# EAGLE design CNC-MainBoard (EAGLE 6.3)
CNC Control Panel Main and Stepper Board Acts as the brain for the whole system Connects to other boards via "slots" in the form of JBUS connectors which carry SPI, system clock and one interrupt line Runs the upload interface via CDC-ACM in USB One dedicated MCU per axis running all the physics for each movement Also reads the limit switches Can do linear or circular movement Can buffer the next move while the current one is executing Can halt movement in progress SPI slave interface + interrupt line to the main MCU
Assembly variants: ProMini, 20MHz
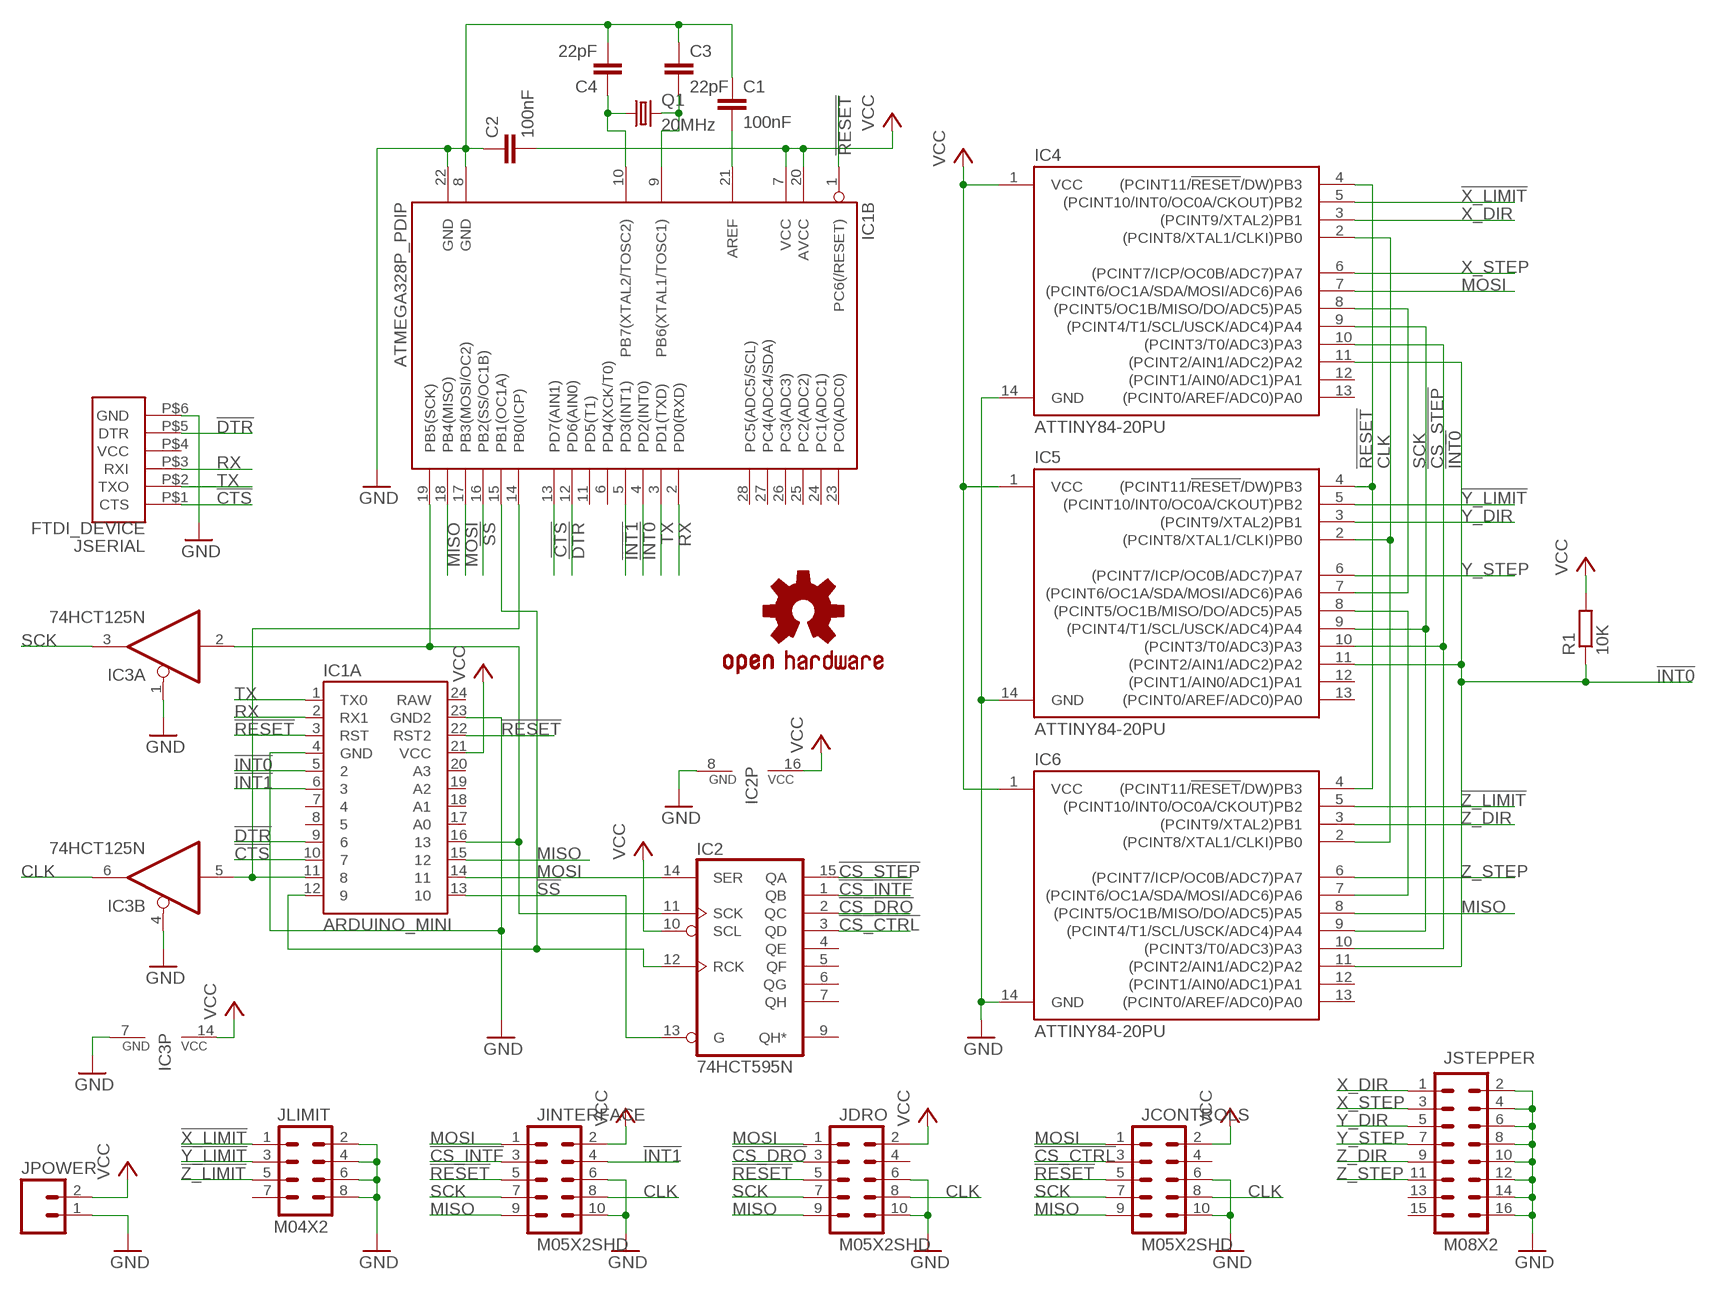
[diagram p0: schematic, sheet 1]

## Parts
C1  100nF  C-EU050-025X075  [C050-025X075]  (not fitted in variant ProMini)
C2  100nF  C-EU050-025X075  [C050-025X075]  (not fitted in variant ProMini)
C3  22pF  C-EU050-025X075  [C050-025X075]  (not fitted in variant ProMini)
C4  22pF  C-EU050-025X075  [C050-025X075]  (not fitted in variant ProMini)
IC1A  ARDUINO_MINI  [ARDUINO_MINI]
IC1B  ATMEGA328P_PDIP  [DIL28-3]  (not fitted in variant ProMini)
IC2  74HCT595N  [DIL16]
IC3  74HCT125N  [DIL14]
IC4  ATTINY84-20PU  [DIL14]
IC5  ATTINY84-20PU  [DIL14]
IC6  ATTINY84-20PU  [DIL14]
JCONTROLS  M05X2SHD  [2X5-SHROUDED]
JDRO  M05X2SHD  [2X5-SHROUDED]
JINTERFACE  M05X2SHD  [2X5-SHROUDED]
JLIMIT  M04X2  [2X4]
JPOWER  M02POLAR  [MOLEX-1X2]
JSERIAL  FTDI_DEVICE  [FTDI_DEVICE_SIDE]
JSTEPPER  M08X2  [2X8]
Q1  20MHz  CRYSTALHC49U-V  [HC49U-V]  (not fitted in variant ProMini)
R1  10K  R-EU_0207/10  [0207/10]
U$1  SPARKFUN_OSHW-LOGOL  [SPARKFUN_OSHW-LOGO-L]

## Nets
!CS_CTRL: IC2.3(QD) JCONTROLS.3
!CS_DRO: IC2.2(QC) JDRO.3
!CS_INTF: IC2.1(QB) JINTERFACE.3
!CS_STEP: IC2.15(QA) IC4.10((PCINT3/T0/ADC3)PA3) IC5.10((PCINT3/T0/ADC3)PA3) IC6.10((PCINT3/T0/ADC3)PA3)
!CTS: IC1A.10 IC1B.13(PD7(AIN1)) JSERIAL.P$1(CTS)
!DTR: IC1A.9 IC1B.12(PD6(AIN0)) JSERIAL.P$5(DTR)
!INT0: IC1A.5 IC1B.4(PD2(INT0)) IC4.11((PCINT2/AIN1/ADC2)PA2) IC5.11((PCINT2/AIN1/ADC2)PA2) IC6.11((PCINT2/AIN1/ADC2)PA2) R1.1
!INT1: IC1A.6 IC1B.5(PD3(INT1)) JINTERFACE.4
!RESET: IC1A.3(RST) IC1A.22(RST2) IC1B.1(PC6(/RESET)) IC4.4((PCINT11/!RESET!/DW)PB3) IC5.4((PCINT11/!RESET!/DW)PB3) IC6.4((PCINT11/!RESET!/DW)PB3) JCONTROLS.5 JDRO.5 JINTERFACE.5
!SS: IC1A.13 IC1B.16(PB2(SS/OC1B)) IC2.13(G)
!X_LIMIT: IC4.5((PCINT10/INT0/OC0A/CKOUT)PB2) JLIMIT.1
!Y_LIMIT: IC5.5((PCINT10/INT0/OC0A/CKOUT)PB2) JLIMIT.3
!Z_LIMIT: IC6.5((PCINT10/INT0/OC0A/CKOUT)PB2) JLIMIT.5
CLK: IC3.6(B:O) IC4.2((PCINT8/XTAL1/CLKI)PB0) IC5.2((PCINT8/XTAL1/CLKI)PB0) IC6.2((PCINT8/XTAL1/CLKI)PB0) JCONTROLS.8 JDRO.8 JINTERFACE.8
CLK_INT: IC1A.11 IC1B.14(PB0(ICP)) IC3.5(B:I)
GND: C1.1 C2.1 C3.1 C4.2 IC1A.4(GND) IC1A.23(GND2) IC1B.8(GND) IC1B.22(GND) IC2.8(GND) IC3.1(A:OE) IC3.4(B:OE) IC3.7(P:GND) IC4.14(GND) IC5.14(GND) IC6.14(GND) JCONTROLS.6 JCONTROLS.10 JDRO.6 JDRO.10 JINTERFACE.6 JINTERFACE.10 JLIMIT.2 JLIMIT.4 JLIMIT.6 JLIMIT.8 JPOWER.1 JSERIAL.P$6(GND) JSTEPPER.2 JSTEPPER.4 JSTEPPER.6 JSTEPPER.8 JSTEPPER.10 JSTEPPER.12 JSTEPPER.14 JSTEPPER.16
MISO: IC1A.15 IC1B.18(PB4(MISO)) IC6.8((PCINT5/OC1B/MISO/DO/ADC5)PA5) JCONTROLS.9 JDRO.9 JINTERFACE.9
MISO_1: IC4.8((PCINT5/OC1B/MISO/DO/ADC5)PA5) IC5.7((PCINT6/OC1A/SDA/MOSI/ADC6)PA6)
MISO_2: IC5.8((PCINT5/OC1B/MISO/DO/ADC5)PA5) IC6.7((PCINT6/OC1A/SDA/MOSI/ADC6)PA6)
MOSI: IC1A.14 IC1B.17(PB3(MOSI/OC2)) IC2.14(SER) IC4.7((PCINT6/OC1A/SDA/MOSI/ADC6)PA6) JCONTROLS.1 JDRO.1 JINTERFACE.1
N$2: C1.2 IC1B.21(AREF)
N$3: C3.2 IC1B.9(PB6(XTAL1/TOSC1)) Q1.2
N$4: C4.1 IC1B.10(PB7(XTAL2/TOSC2)) Q1.1
RX: IC1A.2(RX1) IC1B.2(PD0(RXD)) JSERIAL.P$3(RXI)
SADDR: IC1A.12 IC1B.15(PB1(OC1A)) IC2.12(RCK)
SCK: IC3.3(A:O) IC4.9((PCINT4/T1/SCL/USCK/ADC4)PA4) IC5.9((PCINT4/T1/SCL/USCK/ADC4)PA4) IC6.9((PCINT4/T1/SCL/USCK/ADC4)PA4) JCONTROLS.7 JDRO.7 JINTERFACE.7
SCK_INT: IC1A.16 IC1B.19(PB5(SCK)) IC2.11(SCK) IC3.2(A:I)
TX: IC1A.1(TX0) IC1B.3(PD1(TXD)) JSERIAL.P$2(TXO)
VCC: C2.2 IC1A.21(VCC) IC1B.7(VCC) IC1B.20(AVCC) IC2.10(SCL) IC2.16(VCC) IC3.14(P:VCC) IC4.1(VCC) IC5.1(VCC) IC6.1(VCC) JCONTROLS.2 JDRO.2 JINTERFACE.2 JPOWER.2 R1.2
X_DIR: IC4.3((PCINT9/XTAL2)PB1) JSTEPPER.1
X_STEP: IC4.6((PCINT7/ICP/OC0B/ADC7)PA7) JSTEPPER.3
Y_DIR: IC5.3((PCINT9/XTAL2)PB1) JSTEPPER.5
Y_STEP: IC5.6((PCINT7/ICP/OC0B/ADC7)PA7) JSTEPPER.7
Z_DIR: IC6.3((PCINT9/XTAL2)PB1) JSTEPPER.9
Z_STEP: IC6.6((PCINT7/ICP/OC0B/ADC7)PA7) JSTEPPER.11
Unconnected: IC1A.7 IC1A.8 IC1A.17(A0) IC1A.18(A1) IC1A.19(A2) IC1A.20(A3) IC1A.24(RAW) IC1B.6(PD4(XCK/T0)) IC1B.11(PD5(T1)) IC1B.23(PC0(ADC0)) IC1B.24(PC1(ADC1)) IC1B.25(PC2(ADC2)) IC1B.26(PC3(ADC3)) IC1B.27(PC4(ADC4/SDA)) IC1B.28(PC5(ADC5/SCL)) IC2.4(QE) IC2.5(QF) IC2.6(QG) IC2.7(QH) IC2.9(QH*) IC3.8(C:O) IC3.9(C:I) IC3.10(C:OE) IC3.11(D:O) IC3.12(D:I) IC3.13(D:OE) IC4.12((PCINT1/AIN0/ADC1)PA1) IC4.13((PCINT0/AREF/ADC0)PA0) IC5.12((PCINT1/AIN0/ADC1)PA1) IC5.13((PCINT0/AREF/ADC0)PA0) IC6.12((PCINT1/AIN0/ADC1)PA1) IC6.13((PCINT0/AREF/ADC0)PA0) JCONTROLS.4 JDRO.4 JLIMIT.7 JSERIAL.P$4(VCC) JSTEPPER.13 JSTEPPER.15

## Library data of the parts
C1-C4 = rcl:C-EU: CAPACITOR, European symbol
IC1A = SparkFun-Boards-mine:ARDUINO_MINI: Arduino Pro Mini footprint
IC1B = SparkFun-DigitalIC:ATMEGA328P_PDIP: uC used in the Arduino 32kb flash, 1k EEPROM, 2k SRAM This is the through-hole version of this chip.
IC2 = 74xx-eu:74*595: 8-bit SHIFT REGISTER, output latch
IC3 = 74xx-eu:74*125: Quad bus BUFFER, 3-state
IC4-IC6 = SparkFun-DigitalIC-mine:ATTINY84: Atmel 14-pin 2/4/8kB flash uC
JCONTROLS JDRO JINTERFACE = SparkFun-Connectors:M05X2: Header 5x2 Standard 10-pin dual row 0.1" header. Commonly used with AVR-ISP. Use with Spark Fun Electronics SKU: PRT-00778
JLIMIT = SparkFun-Connectors:M04X2: .1" header, two rows of four.
JPOWER = SparkFun-Connectors:M02: Header 2 Standard 2-pin 0.1" header. Use with straight break away headers (SKU : PRT-00116), right angle break away headers (PRT-00553), swiss pins (PRT-00743), machine pins (PRT-00117), and female headers (PRT-00115). Molex polarized connector foot print use with SKU : PRT-08233 with associated crimp pins and housings.
JSERIAL = SparkFun-Connectors:FTDI_DEVICE: Connector which mates to FTDI basic or FTDI cable.
JSTEPPER = SparkFun-Connectors:M08X2: .1" headers, two rows of 8 each
Q1 = crystal:CRYSTAL: CRYSTAL; OC_FARNELL: 1666969; OC_NEWARK: unknown
R1 = rcl:R-EU_: RESISTOR, European symbol
U$1 = Si4735_Breakout-v10:SPARKFUN_OSHW-LOGO: Open Source Hardware Logo This logo indicates the piece of hardware it is found on incorporates a OSHW license and/or adheres to the definition of open source hardware found here: http://freedomdefined.org/OSHW

## Board
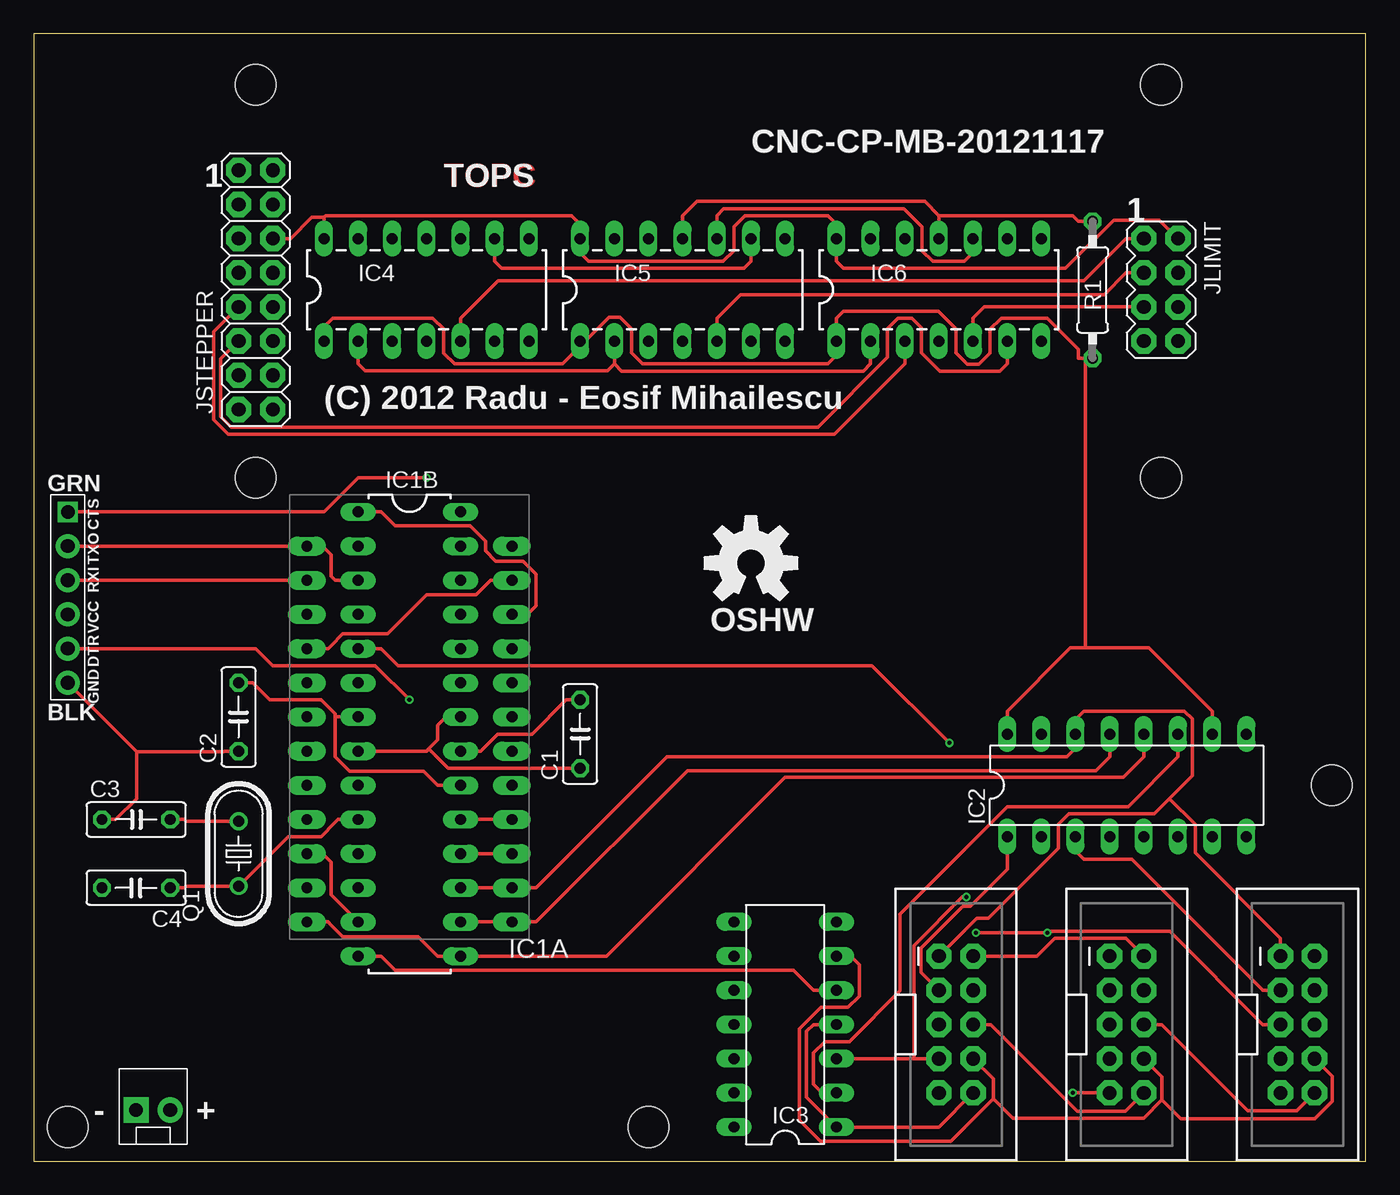
[diagram p1: board, top side]
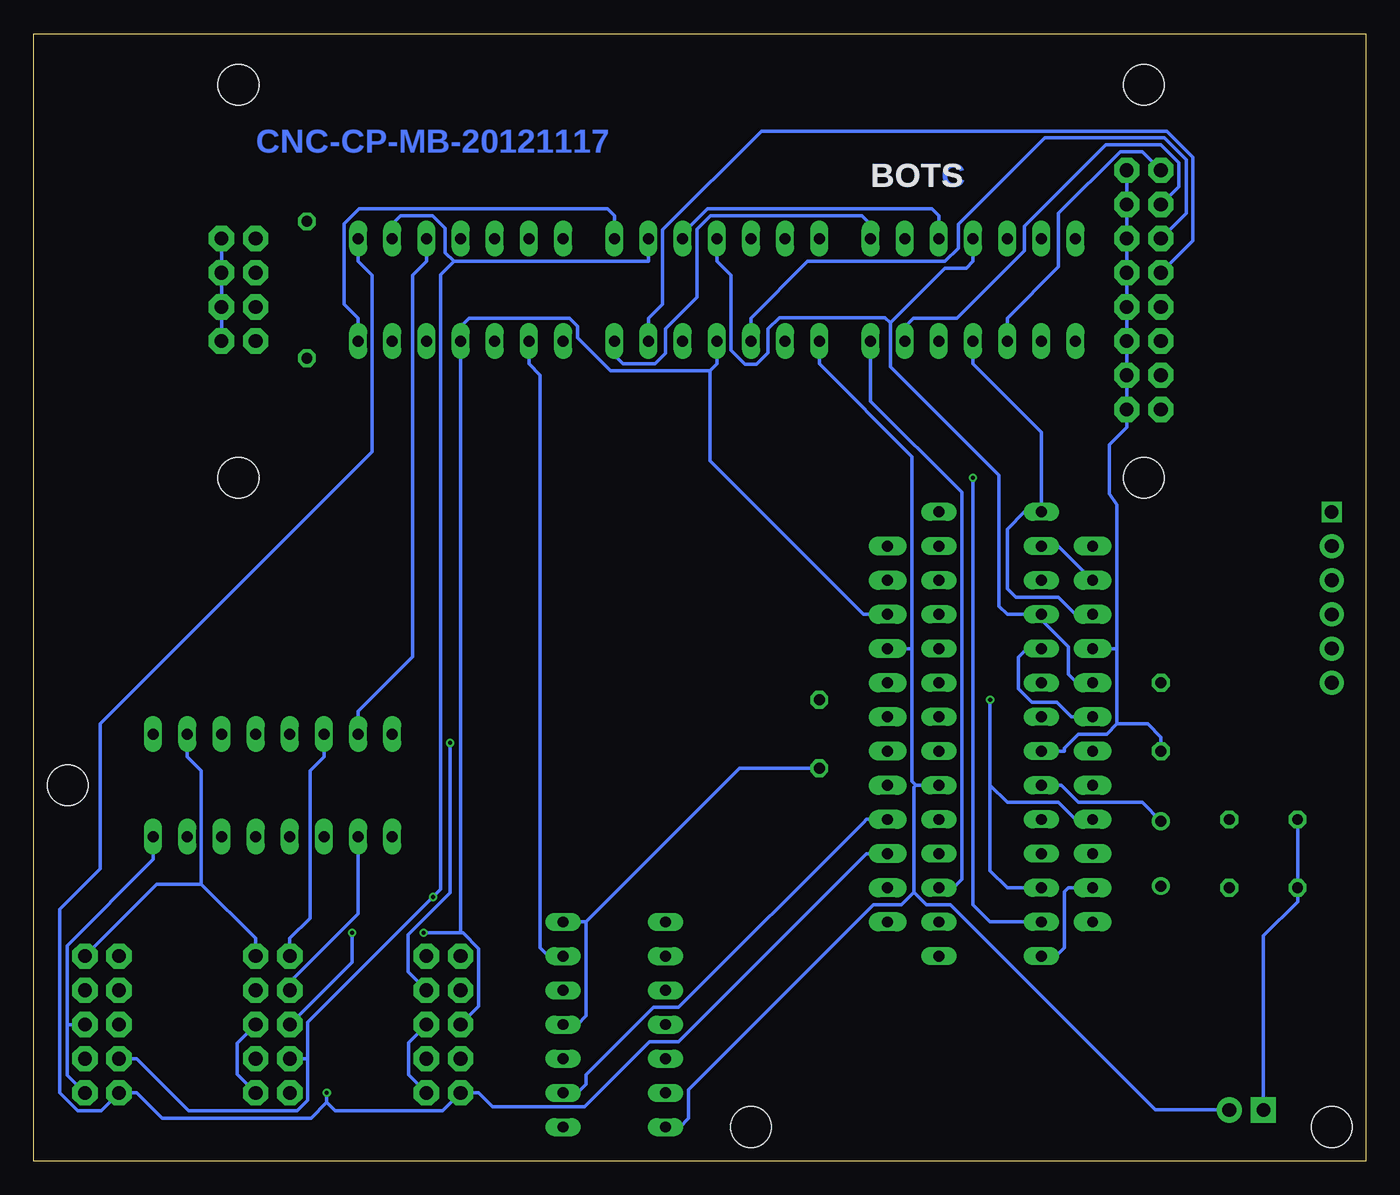
[diagram p2: board, bottom side, seen from below]

Size 99.06 x 83.81 mm. Coordinates in mm from the lower left corner, seen from the top.
Outline: 0,0 99.06,0 99.06,83.81 0,83.81 0,0
Copper layers (1*16): Top 0.035mm / dielectric 1.5mm / Bottom 0.035mm
Design rules "ITEADstudio_DRC": minimum track width 10mil, minimum drill 12mil, track to track 10mil, track to pad 10mil, pad to pad 10mil, via to via 10mil, smd to smd 0mil, copper to edge 20mil, drill to drill 10mil, minimum pad ring 10mil, minimum via ring 6mil, stop-mask expansion 4mil, vias tented up to drill 100mil, thermal gap 10mil
Holes 3.05 mm at 16.51,80.01 83.82,80.01 83.82,50.8 16.51,50.8 96.52,27.94 2.54,2.54 45.72,2.54

### Footprints (pad centres in the part's own frame; a part is rotated, then mirrored left to right if it is on the bottom)
C050-025X075 = drill 0.813 octagon: 1 -2.54,0; 2 2.54,0
ARDUINO_MINI = drill 0.813 pad 1.422 long: 1 -7.62,12.7; 2 -7.62,10.16; 3 -7.62,7.62; 4 -7.62,5.08; 5 -7.62,2.54; 6 -7.62,0; 7 -7.62,-2.54; 8 -7.62,-5.08; 9 -7.62,-7.62; 10 -7.62,-10.16; 11 -7.62,-12.7; 12 -7.62,-15.24; 13 7.62,-15.24; 14 7.62,-12.7; 15 7.62,-10.16; 16 7.62,-7.62; 17 7.62,-5.08; 18 7.62,-2.54; 19 7.62,0; 20 7.62,2.54; 21 7.62,5.08; 22 7.62,7.62; 23 7.62,10.16; 24 7.62,12.7
DIL28-3 = drill 0.813 long: 1 -16.51,-3.81; 2 -13.97,-3.81; 3 -11.43,-3.81; 4 -8.89,-3.81; 5 -6.35,-3.81; 6 -3.81,-3.81; 7 -1.27,-3.81; 8 1.27,-3.81; 9 3.81,-3.81; 10 6.35,-3.81; 11 8.89,-3.81; 12 11.43,-3.81; 13 13.97,-3.81; 14 16.51,-3.81; 15 16.51,3.81; 16 13.97,3.81; 17 11.43,3.81; 18 8.89,3.81; 19 6.35,3.81; 20 3.81,3.81; 21 1.27,3.81; 22 -1.27,3.81; 23 -3.81,3.81; 24 -6.35,3.81; 25 -8.89,3.81; 26 -11.43,3.81; 27 -13.97,3.81; 28 -16.51,3.81
DIL16 = drill 0.813 long: 1 -8.89,-3.81; 2 -6.35,-3.81; 3 -3.81,-3.81; 4 -1.27,-3.81; 5 1.27,-3.81; 6 3.81,-3.81; 7 6.35,-3.81; 8 8.89,-3.81; 9 8.89,3.81; 10 6.35,3.81; 11 3.81,3.81; 12 1.27,3.81; 13 -1.27,3.81; 14 -3.81,3.81; 15 -6.35,3.81; 16 -8.89,3.81
DIL14 = drill 0.813 long: 1 -7.62,-3.81; 2 -5.08,-3.81; 3 -2.54,-3.81; 4 0,-3.81; 5 2.54,-3.81; 6 5.08,-3.81; 7 7.62,-3.81; 8 7.62,3.81; 9 5.08,3.81; 10 2.54,3.81; 11 0,3.81; 12 -2.54,3.81; 13 -5.08,3.81; 14 -7.62,3.81
DIL14' = drill 0.813 long: 1 -8.89,-3.81; 2 -6.35,-3.81; 3 -3.81,-3.81; 4 -1.27,-3.81; 5 1.27,-3.81; 6 3.81,-3.81; 7 6.35,-3.81; 8 6.35,3.81; 9 3.81,3.81; 10 1.27,3.81; 11 -1.27,3.81; 12 -3.81,3.81; 13 -6.35,3.81; 14 -8.89,3.81
2X5-SHROUDED = drill 1.016 pad 1.88 octagon: 1 -1.27,5.08; 2 1.27,5.08; 3 -1.27,2.54; 4 1.27,2.54; 5 -1.27,0; 6 1.27,0; 7 -1.27,-2.54; 8 1.27,-2.54; 9 -1.27,-5.08; 10 1.27,-5.08
2X4 = drill 1.016 pad 1.88 octagon: 1 -3.81,-1.27; 2 -3.81,1.27; 3 -1.27,-1.27; 4 -1.27,1.27; 5 1.27,-1.27; 6 1.27,1.27; 7 3.81,-1.27; 8 3.81,1.27
MOLEX-1X2 = drill 1.016 pad 1.88 square: 1 0,0 | drill 1.016 pad 1.88: 2 2.54,0
FTDI_DEVICE_SIDE = drill 1 square: P$1 -6.35,0 | drill 1.016 pad 1.778: P$2 -3.81,0; P$3 -1.27,0; P$4 1.27,0; P$5 3.81,0; P$6 6.35,0
2X8 = drill 1.016 pad 1.88 octagon: 1 0,0; 2 0,2.54; 3 2.54,0; 4 2.54,2.54; 5 5.08,0; 6 5.08,2.54; 7 7.62,0; 8 7.62,2.54; 9 10.16,0; 10 10.16,2.54; 11 12.7,0; 12 12.7,2.54; 13 15.24,0; 14 15.24,2.54; 15 17.78,0; 16 17.78,2.54
HC49U-V = drill 0.813: 1 -2.413,0; 2 2.413,0
0207/10 = drill 0.813 octagon: 1 -5.08,0; 2 5.08,0

### Placement (x,y rotation side)
C1  40.64,31.75 90 top
C2  15.24,33.02 90 top
C3  7.62,25.4 0 top
C4  7.62,20.32 180 top
IC1A  27.94,33.02 0 top
IC1B  27.94,31.75 270 top
IC2  81.28,27.94 0 top
IC3  55.88,10.16 90 top
IC4  ATTINY84-20PU  [DIL14']  30.48,64.77 0 top
IC5  ATTINY84-20PU  [DIL14']  49.53,64.77 0 top
IC6  ATTINY84-20PU  [DIL14']  68.58,64.77 0 top
JCONTROLS  93.98,10.16 0 top
JDRO  81.28,10.16 0 top
JINTERFACE  68.58,10.16 0 top
JLIMIT  83.82,64.77 270 top
JPOWER  7.62,3.81 0 top
JSERIAL  2.54,41.91 270 top
JSTEPPER  15.24,73.66 270 top
Q1  15.24,22.86 90 top
R1  78.74,64.77 270 top
U$1  53.34,44.45 0 top

### Tracks (layer width: path | path; a pad name or v marks a point on that pad's centre or on a via)
!CS_CTRL
  Top 0.254: IC2.3 77.47,23.06 78.11,22.43 81.66,22.43 91.39,12.7 JCONTROLS.3
!CS_DRO
  Bottom 0.254: JDRO.3 80.01,13.31 74.93,18.39 74.93,22.43 IC2.2
!CS_INTF
  Top 0.254: JINTERFACE.3 65.98,14.03 65.98,15.83 69.1,18.95 69.65,18.95 72.39,21.69 72.39,22.43 IC2.1
!CS_STEP
  Top 0.254: IC6.10 69.85,67.51 69.22,66.88 66.85,66.88 66.04,67.69 66.04,69.47 64.72,70.79 51.31,70.79 50.8,70.28 IC5.10
  Bottom 0.254: IC2.15 74.93,33.45 70.89,37.49 70.89,65.84 69.85,66.88 IC6.10 | IC5.10 50.8,68.94 48.95,70.79 32.26,70.79 31.75,70.28 IC4.10
!CTS  (via drill 0.3 pad 0.61)
  Top 0.254: IC1A.10 21.49,22.86 22.12,22.23 22.12,19.79 IC1B.13 | JSERIAL.P$1 21.59,48.26 24.13,50.8 v29.21,50.8
  Bottom 0.254: v29.21,50.8 29.21,19.05 27.94,17.78 IC1B.13
!DTR  (via drill 0.3 pad 0.61)
  Top 0.254: JSERIAL.P$5 16.51,38.1 17.78,36.83 25.4,36.83 v27.94,34.29
  Bottom 0.254: v27.94,34.29 27.94,27.94 | 27.94,27.94 26.67,26.67 22.86,26.67 21.59,25.4 IC1A.9 | IC1B.12 26.67,20.32 27.94,21.59 27.94,27.94
!INT0
  Top 0.254: IC5.11 48.26,70.28 49.32,71.34 66.25,71.34 67.31,70.28 | 67.31,70.28 67.31,70.25 IC6.11 | R1.1 77.7,69.85 77.27,70.28 67.31,70.28
  Bottom 0.254: 35.36,62.31 31.3,66.37 29.72,66.37 29.21,66.88 IC4.11 | IC5.11 48.26,66.88 47.22,65.84 47.22,60.29 46.16,59.23 45.31,59.23 44.45,60.1 44.45,61.86 43.62,62.69 35.74,62.69 35.36,62.31 | 35.36,62.31 35.36,59.06 27.28,50.98 27.28,41.26 26.64,40.64 24.51,40.64 24.32,40.45 | IC1A.5 21.49,35.56 22.12,36.2 22.12,38.25 24.32,40.45 | IC1B.4 24.32,40.45
!INT1  (via drill 0.3 pad 0.61)
  Top 0.254: IC1B.5 25.83,38.1 27.1,36.83 62.34,36.83 v68.09,31.09
  Bottom 0.254: v68.09,31.09 68.09,19.95 71.22,16.82 71.22,14.07 JINTERFACE.4 | IC1A.6 21.9,33.02 22.12,33.25 22.99,34.11 24.84,34.11 25.83,35.1 25.83,37.47 25.2,38.1 IC1B.5
!RESET  (via drill 0.3 pad 0.61)
  Top 0.254: v70.06,16.97 v75.37,16.97 75.48,17.08 84.47,17.08 91.39,10.16 JCONTROLS.5 | IC1B.1 25.83,48.26 26.87,47.22 32.44,47.22 33.59,46.07 33.59,45.38 34.37,44.6 36.4,44.6 37.36,43.63 37.36,41.27 36.73,40.64 IC1A.22
  Bottom 0.254: 67.31,16.97 v70.06,16.97 | JINTERFACE.5 65.96,11.51 65.96,15.8 67.13,16.97 67.31,16.97 | 67.31,16.97 67.31,59.26 IC6.4 67.31,62.03 66.67,62.66 59.22,62.66 58.62,62.06 58.62,61.22 56.15,58.75 48.77,58.75 | 48.77,58.75 48.26,59.26 IC5.4 | 48.77,58.75 48.77,52.05 37.36,40.64 IC1A.22 | JDRO.5 75.37,14.8 v75.37,16.97 | IC4.4 29.21,59.26 24.13,54.18 IC1B.1 25.4,48.26 26.67,46.99 26.67,42.55 26.04,41.91 22.86,41.91 21.59,40.64 IC1A.3
!SS
  Top 0.254: IC2.13 80.01,30.05 78.99,29.03 48.62,29.03 37.36,17.78 IC1A.13 IC1B.16
!X_LIMIT
  Top 0.254: IC4.5 31.75,62.66 34.52,65.43 78.08,65.43 81.23,68.58 JLIMIT.1
!Y_LIMIT
  Top 0.254: IC5.5 50.8,62.66 52.55,64.41 79.6,64.41 81.23,66.04 JLIMIT.3
!Z_LIMIT
  Top 0.254: IC6.5 69.85,62.66 70.69,63.5 JLIMIT.5
CLK
  Top 0.254: 71.36,4.65 72.8,3.2 82.55,3.2 83.9,4.55 | IC3.6 60.76,15.24 61.39,14.61 61.39,12.26 60.56,11.43 58.54,11.43 56.96,9.85 56.96,3.05 58.52,1.49 68.19,1.49 71.36,4.65 | JINTERFACE.8 71.36,6.11 71.36,4.65 | 83.9,4.55 83.9,6.27 JDRO.8 | 83.9,4.55 85.29,3.17 95.27,3.17 96.57,4.47 96.57,6.3 JCONTROLS.8 | 43.18,59.26 43.71,58.73 61.7,58.73 62.23,59.26 IC6.2 | 43.18,59.26 42.67,58.75 24.64,58.75 24.13,59.26 IC4.2 | IC5.2 43.18,59.26
  Bottom 0.254: IC6.2 62.23,59.26 61.39,58.42 61.39,15.88 60.76,15.24 IC3.6
CLK_INT
  Top 0.254: IC1B.14 25.83,15.24 26.87,14.2 56.49,14.2 57.99,12.7 IC3.5
  Bottom 0.254: IC1A.11 22.12,20.32 22.43,20.02 22.43,15.88 23.06,15.24 IC1B.14
GND
  Top 0.254: JINTERFACE.6 71.17,10.16 77.62,3.71 81.18,3.71 JDRO.10 | JINTERFACE.10 67.31,2.54 IC3.1 57.48,4.75 57.48,9.65 57.99,10.16 IC3.4 | JLIMIT.2 83.72,69.95 80.32,69.95 76.73,66.36 60.2,66.36 59.69,66.88 IC6.14 59.69,69.65 59.05,70.28 52.88,70.28 52.07,69.47 52.07,67.69 51.26,66.88 41.27,66.88 40.64,67.51 IC5.14 40.64,69.65 40.01,70.28 21.72,70.28 21.59,70.16 | IC1A.23 33.98,43.18 33.76,42.95 32.89,42.09 29.2,42.09 26.31,39.19 22.99,39.19 22.12,38.33 21.9,38.1 IC1A.4 | JDRO.6 83.87,10.16 90.27,3.76 93.93,3.76 JCONTROLS.10 | 21.59,70.16 20.68,70.16 19.1,68.58 JSTEPPER.6 | C2.1 14.2,30.48 14.14,30.43 7.67,30.43 | JSERIAL.P$6 7.67,30.43 | 7.67,30.43 7.67,26.95 6.12,25.4 C3.1 | IC4.14 21.59,70.16 | IC1B.22 30.68,33.02 30.05,32.38 30.05,31.32 29.38,30.65 | 29.38,30.65 29.21,30.48 25.83,30.48 IC1B.8 | C1.1 30.82,29.21 29.38,30.65
  Bottom 0.254: IC3.4 58.62,10.16 57.99,10.79 57.99,17.78 | 18.52,38.1 18.52,48.79 19.08,49.61 19.08,53.26 17.78,54.56 JSTEPPER.16 JSTEPPER.14 JSTEPPER.12 JSTEPPER.10 JSTEPPER.8 JSTEPPER.6 JSTEPPER.4 JSTEPPER.2 | 18.52,32.51 18.52,38.1 | 18.52,32.51 19.27,31.75 21.38,31.75 22.43,30.7 22.43,30.48 IC1B.8 | 18.52,32.51 16.22,32.51 15.24,31.52 C2.1 | IC1A.4 18.52,38.1 | IC2.8 90.17,22.43 96.57,16.03 96.57,10.16 | 96.57,10.16 96.57,6.4 JCONTROLS.10 | JCONTROLS.6 96.57,10.16 | IC3.7 57.99,17.78 | C1.1 46.56,29.21 57.99,17.78 | JDRO.10 83.93,6.46 83.93,8.78 JDRO.6 | JINTERFACE.10 71.19,6.42 71.19,8.82 JINTERFACE.6 | JPOWER.1 7.62,16.74 5.08,19.28 C4.2 C3.1 | JLIMIT.2 JLIMIT.4 JLIMIT.6 JLIMIT.8
MISO  (via drill 0.3 pad 0.61)
  Top 0.254: JDRO.9 v77.26,5.08 | IC1B.18 IC1A.15
  Bottom 0.254: IC1A.15 37.15,22.86 37.36,22.64 51.12,8.89 53.25,8.89 58.1,4.04 64.95,4.04 65.99,5.08 JINTERFACE.9 68.64,3.75 76.65,3.75 77.26,4.36 | 77.26,4.36 v77.26,5.08 | 77.26,4.36 78.42,3.2 89.51,3.2 91.39,5.08 JCONTROLS.9 94.03,3.76 95.8,3.76 97.13,5.09 97.13,18.72 94.11,21.75 94.11,32.5 73.89,52.72 73.89,65.84 74.93,66.88 IC6.8
MISO_1
  Bottom 0.254: IC4.8 36.83,69.65 37.47,70.28 48.74,70.28 49.73,69.29 49.73,64.22 52.07,61.89 52.07,60.05 52.87,59.26 55.24,59.26 55.88,59.89 IC5.7
MISO_2
  Bottom 0.254: IC5.8 55.88,70.28 56.39,70.79 74.86,70.79 75.97,69.68 75.97,63.7 74.93,62.66 IC6.7
MOSI
  Top 0.254: 84.46,26.95 83.34,25.83 76.99,25.83 76.2,25.04 76.2,23.26 71,18.05 70.12,18.05 JINTERFACE.1 | 84.46,26.95 86.15,28.64 86.15,32.88 85.57,33.45 78.11,33.45 77.47,32.82 IC2.14 77.47,30.68 76.83,30.05 47.09,30.05 37.36,20.32 IC1A.14 IC1B.17 | 84.46,26.95 86.36,25.06 86.36,22.91 92.71,16.56 JCONTROLS.1
  Bottom 0.254: IC1B.17 30.68,20.32 30.05,20.95 30.05,49.72 36.83,56.5 IC4.7 | IC2.14 77.47,30.05 78.51,29.01 78.51,18.06 80.01,16.56 JDRO.1
N$2
  Top 0.254: C1.2 39.6,34.29 37.06,31.75 34.5,31.75 33.45,30.7 33.23,30.48 IC1B.21
N$3
  Top 0.254: C3.2 11.2,25.4 11.33,25.27 Q1.2
  Bottom 0.254: IC1B.9 22.64,27.94 22.43,27.72 21.37,26.67 16.64,26.67 Q1.2
N$4
  Top 0.254: IC1B.10 22.64,25.4 22.43,25.18 21.37,24.13 18.92,24.13 Q1.1 11.33,20.45 11.2,20.32 C4.1
RX
  Top 0.254: JSERIAL.P$3 IC1A.2
  Bottom 0.254: IC1B.2 22.86,45.72 IC1A.2
SADDR
  Top 0.254: IC2.12 82.55,30.05 81.03,28.52 55.88,28.52 42.6,15.24 IC1B.15 30.05,15.24 28.6,16.69 22.99,16.69 22.12,17.55 21.9,17.78 IC1A.12
SCK  (via drill 0.3 pad 0.61)
  Top 0.254: 65.45,7.62 JINTERFACE.7 | IC3.3 65.45,7.62 | 65.45,7.62 65.45,16.02 69.07,19.64 v69.37,19.64 | IC5.9 53.34,66.88 52.83,66.37 34.8,66.37 34.29,66.88 IC4.9
  Bottom 0.254: 78.69,7.62 78.69,10.32 v69.37,19.64 68.81,20.2 68.81,65.88 67.81,66.88 | 67.81,66.88 68.45,67.52 68.45,69.33 69.4,70.28 71.75,70.28 72.39,69.65 IC6.9 | 67.81,66.88 53.34,66.88 IC5.9 | 78.69,7.62 78.69,4.53 79.46,3.76 87.53,3.76 91.39,7.62 JCONTROLS.7 | JDRO.7 78.69,7.62
SCK_INT
  Top 0.254: IC2.11 85.09,30.05 81.38,26.34 72.39,26.34 64.42,18.37 64.42,12.65 60.66,8.89 58.83,8.89 57.99,8.05 57.99,5.71 58.62,5.08 IC3.2 | IC1B.19 IC1A.16
  Bottom 0.254: IC1A.16 37.14,25.4 37.36,25.17 51.11,11.43 52.98,11.43 57.99,6.42 57.99,5.71 58.62,5.08 IC3.2
TX
  Top 0.254: IC1B.3 22.43,43.18 22.12,43.48 22.12,45.09 21.49,45.72 IC1A.1 JSERIAL.P$2
VCC
  Top 0.254: 78.22,38.16 77.09,38.16 72.39,33.45 IC2.16 | 78.22,38.16 82.92,38.16 87.63,33.45 IC2.10 | 78.22,59.69 78.22,38.16 | 78.22,59.69 77.7,59.69 77.7,60.34 75.38,62.66 71.95,62.66 71.12,61.83 71.12,60.07 70.3,59.25 69.43,59.25 68.58,60.1 68.58,61.86 67.27,63.17 60.2,63.17 59.69,62.66 IC6.1 59.69,59.89 59.05,59.26 45.29,59.26 44.45,60.1 44.45,61.87 43.61,62.71 42.77,62.71 40.64,60.58 | R1.2 78.22,59.69 | JDRO.2 81.22,16.57 75.94,16.57 74.61,15.24 71.17,15.24 JINTERFACE.2 | IC4.1 21.59,62.03 22.23,62.66 29.68,62.66 30.48,61.86 30.48,60.07 31.29,59.26 39.32,59.26 40.64,60.58 | IC5.1 40.64,60.58 | IC1B.20 30.05,27.94 29.01,28.98 23.49,28.98 22.43,30.05 22.43,33.02 | C2.2 16.28,35.56 17.55,34.29 21.38,34.29 22.43,33.24 22.43,33.02 | IC1B.7 22.43,33.02
  Bottom 0.254: 86.59,20.6 82.55,16.56 JDRO.2 | 86.59,20.6 86.59,29.01 87.63,30.05 IC2.10 | 86.59,20.6 89.89,20.6 JCONTROLS.2 | 33.6,19.99 33.6,27.79 33.45,27.94 | JPOWER.2 15.64,3.81 30.88,19.05 32.66,19.05 33.6,19.99 | 33.6,19.99 34.55,19.05 36.61,19.05 50.37,5.29 50.37,3.17 51,2.54 IC3.14 | IC1B.20 33.45,27.94 | 33.76,38.1 33.76,28.25 33.45,27.94 | 33.76,38.1 33.88,38.1 IC1A.21 | IC5.1 40.64,59.26 33.76,52.38 33.76,38.1
X_DIR
  Bottom 0.254: IC4.3 26.67,62.66 22.86,66.47 22.86,70.45 18.27,75.04 16.62,75.04 JSTEPPER.1
X_STEP
  Bottom 0.254: JSTEPPER.3 13.91,72.44 13.91,74.22 15.24,75.55 19.34,75.55 25.4,69.49 25.4,67.68 30.42,62.66 33.66,62.66 34.29,62.03 IC4.6
Y_DIR
  Bottom 0.254: IC5.3 45.72,62.66 41.5,66.88 31.29,66.88 30.3,67.87 30.3,69.62 23.87,76.06 15,76.06 13.37,74.42 13.37,70.45 JSTEPPER.5
Y_STEP
  Bottom 0.254: IC5.6 53.34,62.66 52.3,63.7 52.3,69.22 44.95,76.57 14.79,76.57 12.86,74.64 12.86,68.42 JSTEPPER.7
Z_DIR
  Top 0.254: JSTEPPER.9 13.4,61.66 13.4,55.11 14.46,54.05 59.56,54.05 64.77,59.26 IC6.3
Z_STEP
  Top 0.254: IC6.6 72.39,59.26 71.85,58.72 67.39,58.72 66,60.11 66,61.96 65.3,62.66 64.27,62.66 63.5,61.89 63.5,59.74 58.32,54.56 14.67,54.56 13.91,55.32 13.91,59.63 JSTEPPER.11

### Text on the board
Top: TOPC
Bottom: CNC-CP-MB-20121117 | BOTC
tPlace: CNC-CP-MB-20121117 | 1 | TOPS | 1 | (C) 2012 Radu - Eosif Mihailescu | OSHW | - | +
bPlace: BOTS